# EAGLE schematic giraffe-cjd-simple (EAGLE 9.1.0)
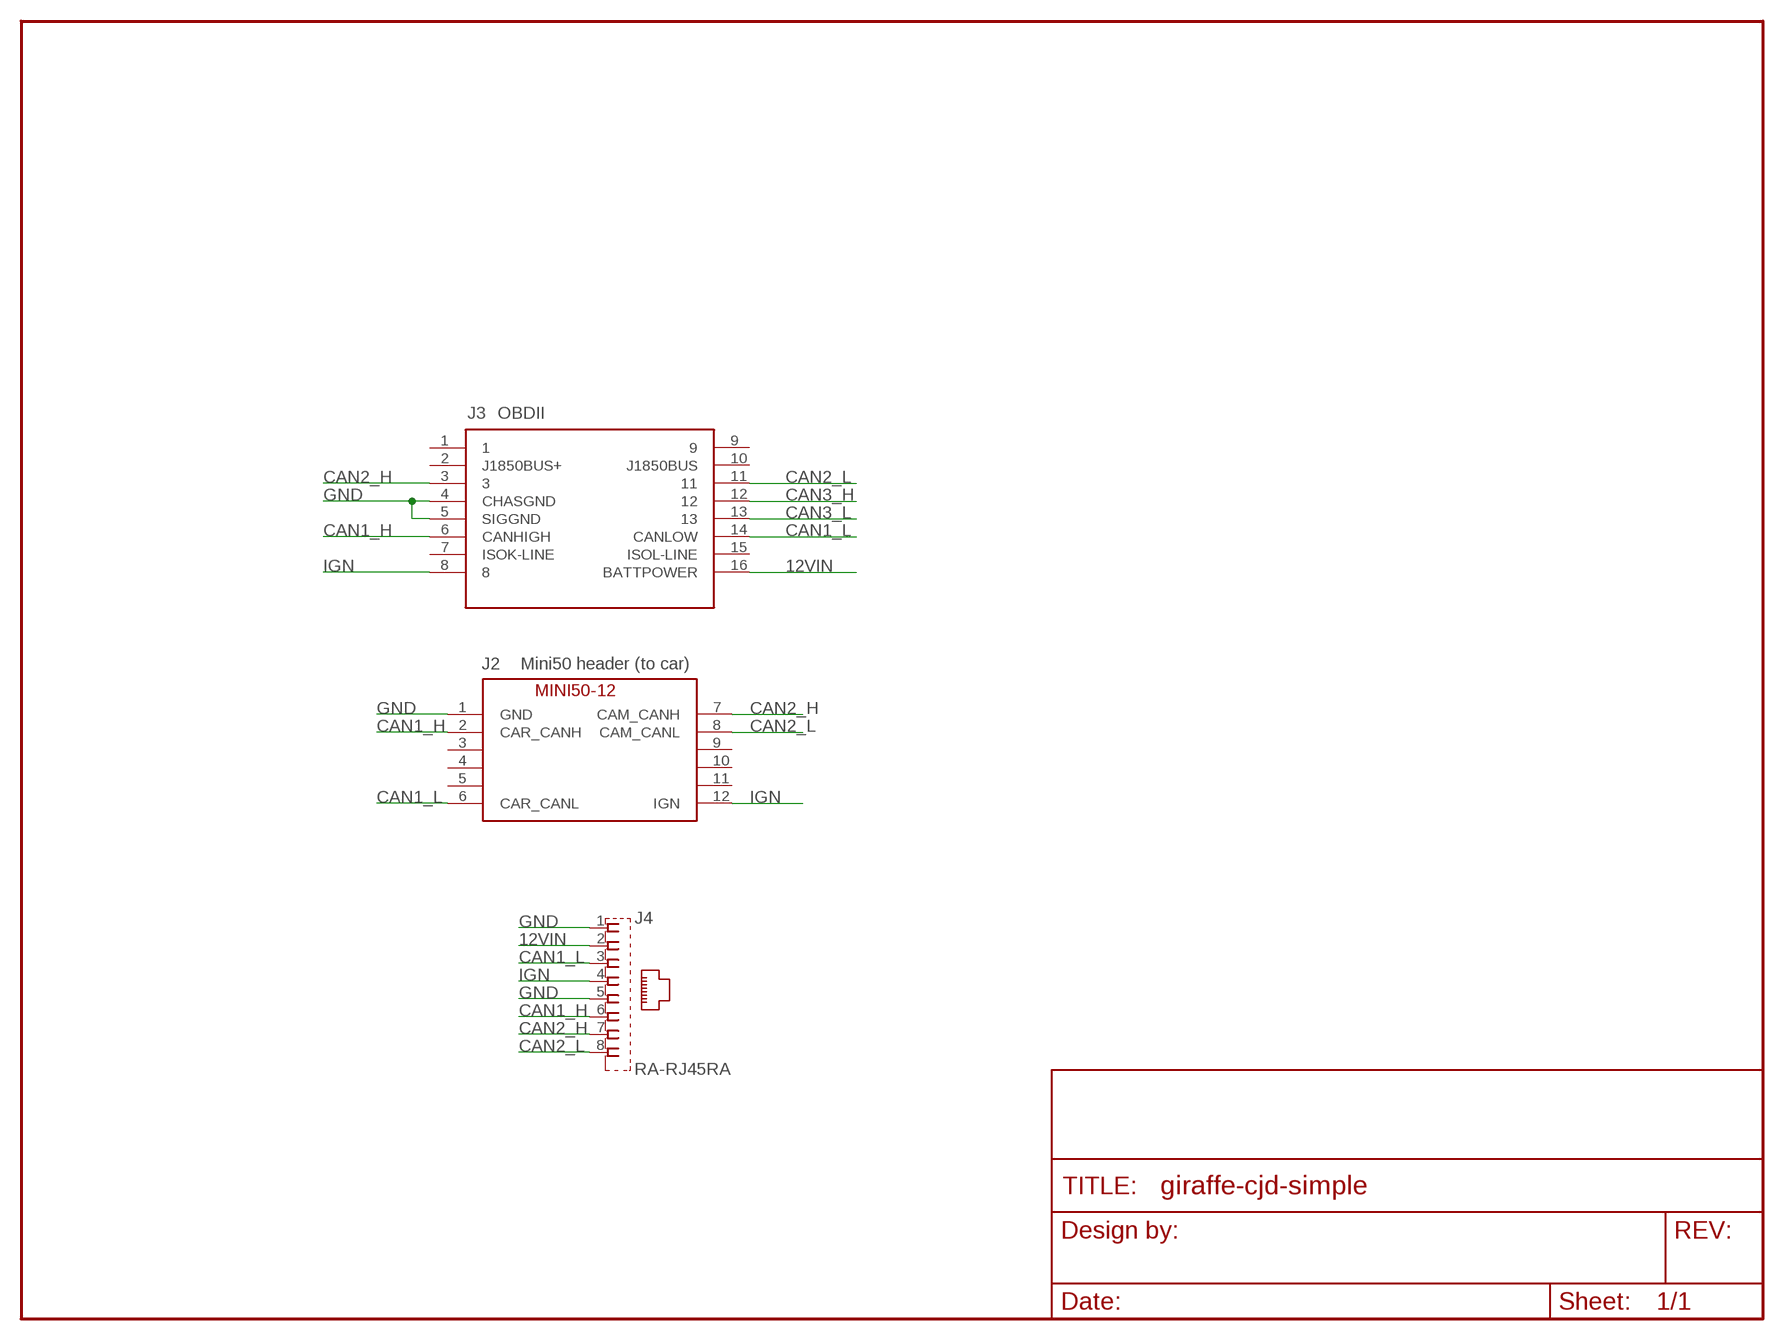
[diagram p0: schematic, sheet 1]

## Parts
FRAME1  FRAME-LETTERNO_PACKAGE  [DUMMY]
J2  MINI50MINI50-12-VERT  [MINI50-12]
J3  OBDII-FEMALE-CUT  [OBDII-FEMALE-MIDCUT]
J4  RA-RJ45RA  [RA-RJ45]

## Nets
12VIN: J3.16(BATTPOWER) J4.2
CAN1_H: J2.2(CAR_CANH) J3.6(CANHIGH) J4.6
CAN1_L: J2.6(CAR_CANL) J3.14(CANLOW) J4.3
CAN2_H: J2.7(CAM_CANH) J3.3 J4.7
CAN2_L: J2.8(CAM_CANL) J3.11 J4.8
CAN3_H: J3.12
CAN3_L: J3.13
GND: J2.1(GND) J3.4(CHASGND) J3.5(SIGGND) J4.1 J4.5
IGN: J2.12(IGN) J3.8 J4.4
Unconnected: J2.3 J2.4 J2.5 J2.9 J2.10 J2.11 J3.1 J3.2(J1850BUS+) J3.7(ISOK-LINE) J3.9 J3.10(J1850BUS) J3.15(ISOL-LINE)

## Notes on the sheet
- OBDII
- Mini50 header (to car)

## Library data of the parts
FRAME1 = SparkFun-Aesthetics:FRAME-LETTER: Schematic Frame Standard 8.5x11 US Letter frame; DESIGNER: adhintz; VERSION: v01
J2 = comma2.ai:MINI50: mini50 12 vertical header
J3 = comma.ai:OBDII-FEMALE
J4 = comma.ai:RA-RJ45